# Altium schematic sheet secondary_decoupling.SchDoc: foxBMS BMS-Slave 12-Cell
size A3; DocumentNumber: 6; SheetNumber: 6; SheetTotal: 19; AUTHOR: Fraunhofer IISB foxBMS Team; SheetDescription: Secondary Voltage Measurement
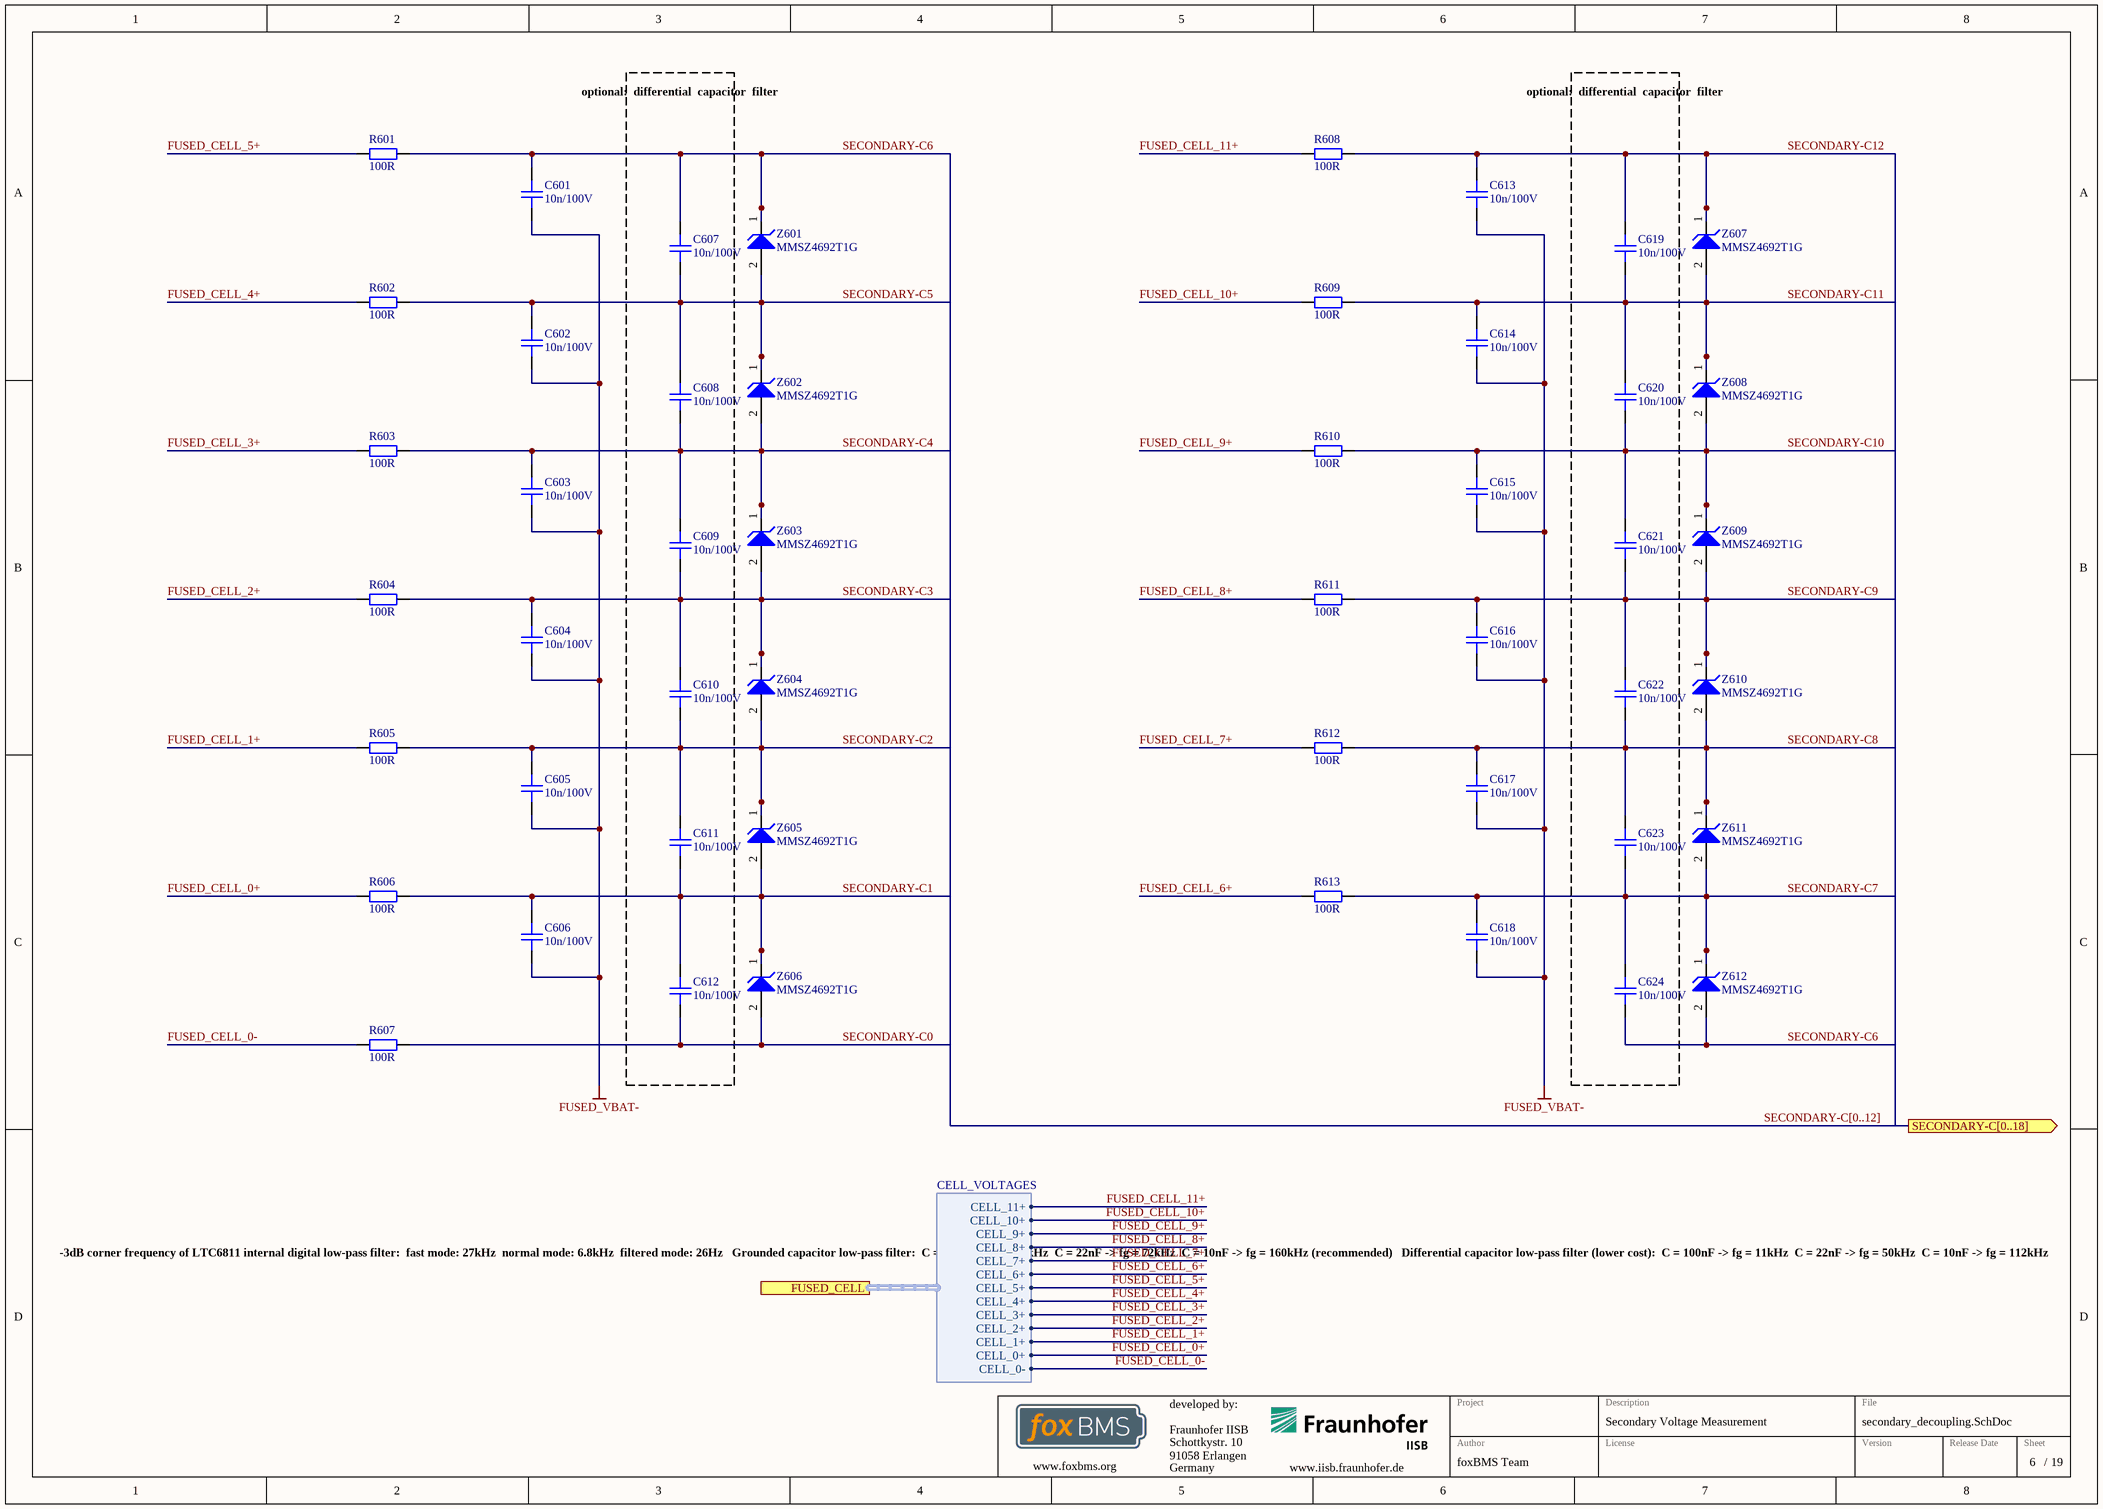
[diagram p0: secondary_decoupling.SchDoc]

## Parts
C601  10n/100V  [CAPC1608X08N]
C602  10n/100V  [CAPC1608X08N]
C603  10n/100V  [CAPC1608X08N]
C604  10n/100V  [CAPC1608X08N]
C605  10n/100V  [CAPC1608X08N]
C606  10n/100V  [CAPC1608X08N]
C607  10n/100V  [CAPC1608X08N]
C608  10n/100V  [CAPC1608X08N]
C609  10n/100V  [CAPC1608X08N]
C610  10n/100V  [CAPC1608X08N]
C611  10n/100V  [CAPC1608X08N]
C612  10n/100V  [CAPC1608X08N]
C613  10n/100V  [CAPC1608X08N]
C614  10n/100V  [CAPC1608X08N]
C615  10n/100V  [CAPC1608X08N]
C616  10n/100V  [CAPC1608X08N]
C617  10n/100V  [CAPC1608X08N]
C618  10n/100V  [CAPC1608X08N]
C619  10n/100V  [CAPC1608X08N]
C620  10n/100V  [CAPC1608X08N]
C621  10n/100V  [CAPC1608X08N]
C622  10n/100V  [CAPC1608X08N]
C623  10n/100V  [CAPC1608X08N]
C624  10n/100V  [CAPC1608X08N]
R601  100R  [RESC1608X05N]
R602  100R  [RESC1608X05N]
R603  100R  [RESC1608X05N]
R604  100R  [RESC1608X05N]
R605  100R  [RESC1608X05N]
R606  100R  [RESC1608X05N]
R607  100R  [RESC1608X05N]
R608  100R  [RESC1608X05N]
R609  100R  [RESC1608X05N]
R610  100R  [RESC1608X05N]
R611  100R  [RESC1608X05N]
R612  100R  [RESC1608X05N]
R613  100R  [RESC1608X05N]
Z601  MMSZ4692T1G  [ONSC-SOD-123-2-425-04_V]
Z602  MMSZ4692T1G  [ONSC-SOD-123-2-425-04_V]
Z603  MMSZ4692T1G  [ONSC-SOD-123-2-425-04_V]
Z604  MMSZ4692T1G  [ONSC-SOD-123-2-425-04_V]
Z605  MMSZ4692T1G  [ONSC-SOD-123-2-425-04_V]
Z606  MMSZ4692T1G  [ONSC-SOD-123-2-425-04_V]
Z607  MMSZ4692T1G  [ONSC-SOD-123-2-425-04_V]
Z608  MMSZ4692T1G  [ONSC-SOD-123-2-425-04_V]
Z609  MMSZ4692T1G  [ONSC-SOD-123-2-425-04_V]
Z610  MMSZ4692T1G  [ONSC-SOD-123-2-425-04_V]
Z611  MMSZ4692T1G  [ONSC-SOD-123-2-425-04_V]
Z612  MMSZ4692T1G  [ONSC-SOD-123-2-425-04_V]

## Blocks framed on the sheet
optional: / differential / capacitor / filter: C607-C612
optional: / differential / capacitor / filter: C619-C624

## Ports
FUSED_CELL (harness CELL_VOLTAGES), SECONDARY-C[0..18] (out)

## Harnesses
CELL_VOLTAGES: CELL_0-, CELL_0+, CELL_1+, CELL_10+, CELL_11+, CELL_2+, CELL_3+, CELL_4+, CELL_5+, CELL_6+, CELL_7+, CELL_8+, CELL_9+

## Nets
FUSED_VBAT-: C601.2 C602.2 C603.2 C604.2 C605.2 C606.2 C613.2 C614.2 C615.2 C616.2 C617.2 C618.2
FUSED_CELL_0+: R606.1 ; port FUSED_CELL.CELL_0+
FUSED_CELL_0-: R607.1 ; port FUSED_CELL.CELL_0-
FUSED_CELL_1+: R605.1 ; port FUSED_CELL.CELL_1+
FUSED_CELL_2+: R604.1 ; port FUSED_CELL.CELL_2+
FUSED_CELL_3+: R603.1 ; port FUSED_CELL.CELL_3+
FUSED_CELL_4+: R602.1 ; port FUSED_CELL.CELL_4+
FUSED_CELL_5+: R601.1 ; port FUSED_CELL.CELL_5+
FUSED_CELL_6+: R613.1 ; port FUSED_CELL.CELL_6+
FUSED_CELL_7+: R612.1 ; port FUSED_CELL.CELL_7+
FUSED_CELL_8+: R611.1 ; port FUSED_CELL.CELL_8+
FUSED_CELL_9+: R610.1 ; port FUSED_CELL.CELL_9+
FUSED_CELL_10+: R609.1 ; port FUSED_CELL.CELL_10+
FUSED_CELL_11+: R608.1 ; port FUSED_CELL.CELL_11+
SECONDARY-C0: C612.2 R607.2 Z606.2(A)
SECONDARY-C1: C606.1 C611.2 C612.1 R606.2 Z605.2(A) Z606.1(K)
SECONDARY-C2: C605.1 C610.2 C611.1 R605.2 Z604.2(A) Z605.1(K)
SECONDARY-C3: C604.1 C609.2 C610.1 R604.2 Z603.2(A) Z604.1(K)
SECONDARY-C4: C603.1 C608.2 C609.1 R603.2 Z602.2(A) Z603.1(K)
SECONDARY-C5: C602.1 C607.2 C608.1 R602.2 Z601.2(A) Z602.1(K)
SECONDARY-C6: C601.1 C607.1 C624.2 R601.2 Z601.1(K) Z612.2(A)
SECONDARY-C7: C618.1 C623.2 C624.1 R613.2 Z611.2(A) Z612.1(K)
SECONDARY-C8: C617.1 C622.2 C623.1 R612.2 Z610.2(A) Z611.1(K)
SECONDARY-C9: C616.1 C621.2 C622.1 R611.2 Z609.2(A) Z610.1(K)
SECONDARY-C10: C615.1 C620.2 C621.1 R610.2 Z608.2(A) Z609.1(K)
SECONDARY-C11: C614.1 C619.2 C620.1 R609.2 Z607.2(A) Z608.1(K)
SECONDARY-C12: C613.1 C619.1 R608.2 Z607.1(K)

## Buses and harness runs
bus SECONDARY-C[0..12] = port SECONDARY-C[0..18]

## Notes on the sheet
- -3dB corner frequency of LTC6811 internal digital low-pass filter:
  fast mode: 27kHz
  normal mode: 6.8kHz
  filtered mode: 26Hz
  Grounded capacitor low-pass filter:
  C = 100nF -> fg = 16kHz
  C = 22nF -> fg = 72kHz
  C = 10nF -> fg = 160kHz (recommended)
  Differential capacitor low-pass filter (lower cost):
  C = 100nF -> fg = 11kHz
  C = 22nF -> fg = 50kHz
  C = 10nF -> fg = 112kHz
- Fraunhofer IISB
- Schottkystr. 10
- developed by:
- 91058 Erlangen
- Germany
- Author
- Project
- License
- Description
- File
- Version
- Release Date
- Sheet
- www.foxbms.org
- www.iisb.fraunhofer.de
- foxBMS Team
- /

## Library data of the parts
C601-C624 = gen_C_ceramic_10n_100V_X7R_0603: MLCC; Capacitance: 10n; Rated Voltage: 100V; Dielectric: X7R; Case EIA: 0603; Case Metric: 1608; Automotive Qualified: False; Part Number: gen_C_ceramic_10n_100V_X7R_0603; Supplier 1: Farnell; Supplier Part Number 1: 1865545
R601-R613 = gen_R_100R_0603: SMD Resistor 100R 0603; Tolerance: 1%; Power: 0.1W; Case EIA: 0603; Case Metric: 1608; Maximum Working Voltage: 75V; PnP Package: R_0603; Automotive Qualified: False; Part Number: gen_R_100R_0603; Operating Temperature: -55°C - +155°C; Resistance: 100R; Series: E24, E96; PnP Value: 100R; Supplier 1: Farnell; Supplier Part Number 1: 1469752
Z601-Z612 = CMP-1060-00434-1: Zener Voltage Regulator, 500 mW, 2-Pin SOD-123, Pb-Free, Tape and Reel; Manufacturer: On Semiconductor; VZ Typ (V): 6.8; P Max (W): 0.5; ComponentLink2URL: http://www.onsemi.com/pub_link/Collateral/MMSZ4678T1-D.PDF; Mounting Technology: Surface Mount; DatasheetVersion: Rev. 9; ComponentLink1Description: Manufacturer URL; ComponentLink3URL: http://www.onsemi.com/pub_link/Collateral/425-04.PDF; PackageReference: SOD-123-2-425-04; ComponentLink2Description: Datasheet; RoHS: Pb-Free; Packing: Tape and Reel; ComponentLink1URL: http://www.onsemi.com/; PackageDescription: 2-Pin SOD, Body 1.6 x 2.69 mm; ComponentLink3Description: Package Specification; PartNumber: MMSZ4692T1G; PackageVersion: Rev. G, 10/2009